# EAGLE design adapter_smd_1.0 (EAGLE 5.10)
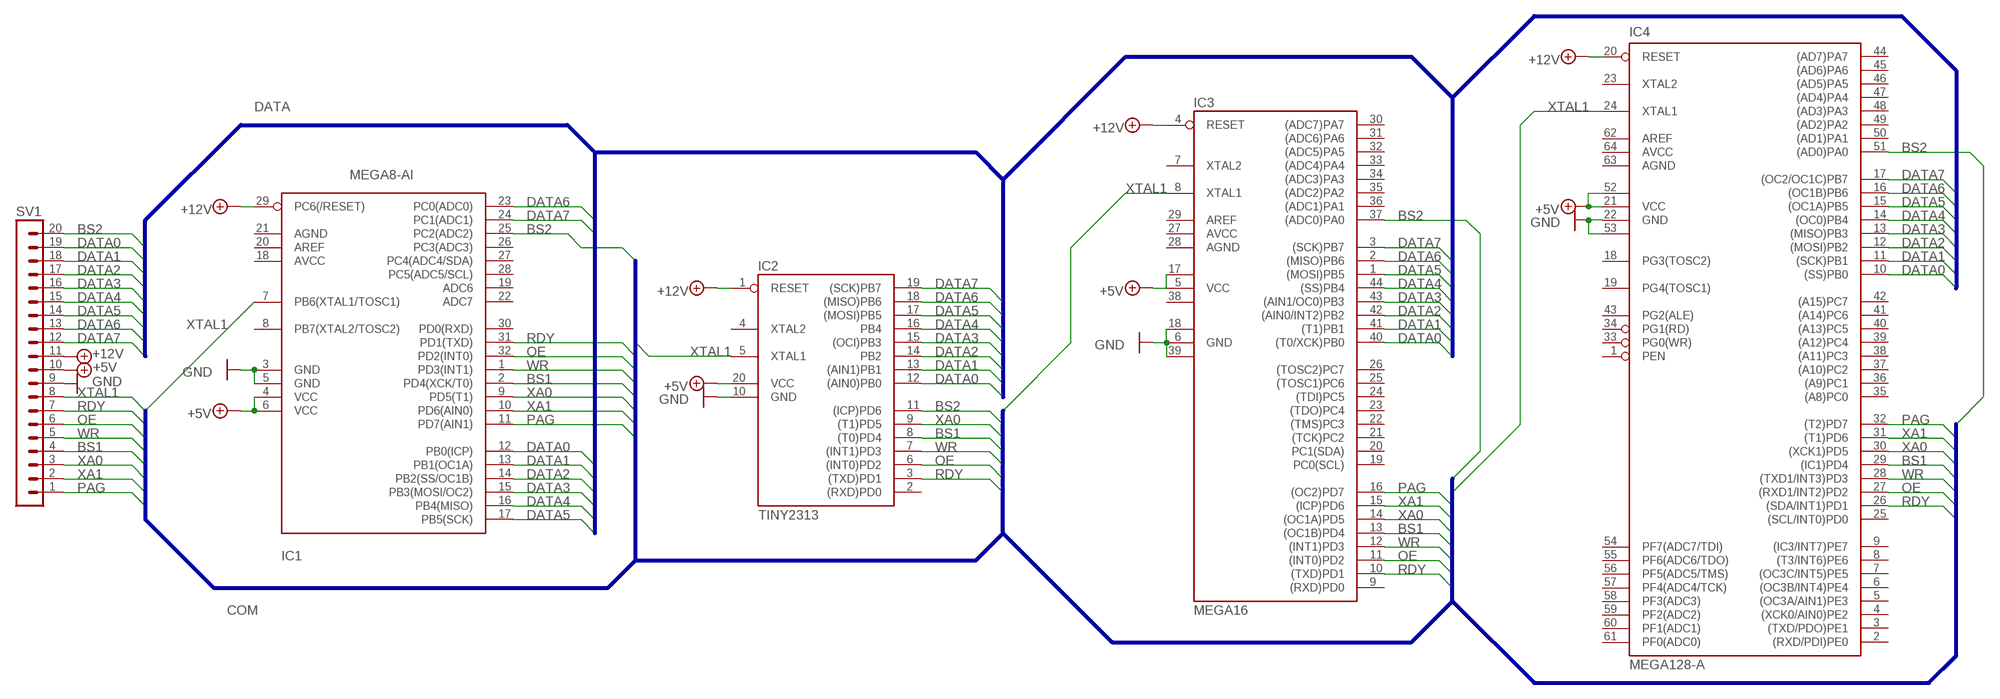
[diagram p0: schematic, sheet 1]

## Parts
IC1  MEGA8-AI  [TQFP32-08]
IC2  TINY2313  AT90S2313S  [SO20L]
IC3  MEGA16  MEGA16-A  [TQFP44]
IC4  MEGA128-A  [TQFP64]
SV1  MA20-1  [MA20-1]

## Nets
+5V: IC1.4(VCC) IC1.6(VCC) IC2.20(VCC) IC3.5(VCC) IC3.17(VCC1) IC4.21(VCC) IC4.52(VCC1) SV1.10
+12V: IC1.29(PC6(/RESET)) IC2.1(RESET) IC3.4(RESET) IC4.20(RESET) SV1.11
BS1: IC1.2(PD4(XCK/T0)) IC2.8((T0)PD4) IC3.13((OC1B)PD4) IC4.29((IC1)PD4) SV1.4
BS2: IC1.25(PC2(ADC2)) IC2.11((ICP)PD6) IC3.37((ADC0)PA0) IC4.51((AD0)PA0) SV1.20
DATA0: IC1.12(PB0(ICP)) IC2.12((AIN0)PB0) IC3.40((T0/XCK)PB0) IC4.10((SS)PB0) SV1.19
DATA1: IC1.13(PB1(OC1A)) IC2.13((AIN1)PB1) IC3.41((T1)PB1) IC4.11((SCK)PB1) SV1.18
DATA2: IC1.14(PB2(SS/OC1B)) IC2.14(PB2) IC3.42((AIN0/INT2)PB2) IC4.12((MOSI)PB2) SV1.17
DATA3: IC1.15(PB3(MOSI/OC2)) IC2.15((OCI)PB3) IC3.43((AIN1/OC0)PB3) IC4.13((MISO)PB3) SV1.16
DATA4: IC1.16(PB4(MISO)) IC2.16(PB4) IC3.44((SS)PB4) IC4.14((OC0)PB4) SV1.15
DATA5: IC1.17(PB5(SCK)) IC2.17((MOSI)PB5) IC3.1((MOSI)PB5) IC4.15((OC1A)PB5) SV1.14
DATA6: IC1.23(PC0(ADC0)) IC2.18((MISO)PB6) IC3.2((MISO)PB6) IC4.16((OC1B)PB6) SV1.13
DATA7: IC1.24(PC1(ADC1)) IC2.19((SCK)PB7) IC3.3((SCK)PB7) IC4.17((OC2/OC1C)PB7) SV1.12
GND: IC1.3(GND) IC1.5(GND) IC2.10(GND) IC3.6(GND) IC3.18(GND1) IC3.39(GND2) IC4.22(GND) IC4.53(GND1) SV1.9
OE: IC1.32(PD2(INT0)) IC2.6((INT0)PD2) IC3.11((INT0)PD2) IC4.27((RXD1/INT2)PD2) SV1.6
PAG: IC1.11(PD7(AIN1)) IC3.16((OC2)PD7) IC4.32((T2)PD7) SV1.1
RDY: IC1.31(PD1(TXD)) IC2.3((TXD)PD1) IC3.10((TXD)PD1) IC4.26((SDA/INT1)PD1) SV1.7
WR: IC1.1(PD3(INT1)) IC2.7((INT1)PD3) IC3.12((INT1)PD3) IC4.28((TXD1/INT3)PD3) SV1.5
XA0: IC1.9(PD5(T1)) IC2.9((T1)PD5) IC3.14((OC1A)PD5) IC4.30((XCK1)PD5) SV1.3
XA1: IC1.10(PD6(AIN0)) IC3.15((ICP)PD6) IC4.31((T1)PD6) SV1.2
XTAL1: IC1.7(PB6(XTAL1/TOSC1)) IC2.5(XTAL1) IC3.8(XTAL1) IC4.24(XTAL1) SV1.8
Unconnected: IC1.8(PB7(XTAL2/TOSC2)) IC1.18(AVCC) IC1.19(ADC6) IC1.20(AREF) IC1.21(AGND) IC1.22(ADC7) IC1.26(PC3(ADC3)) IC1.27(PC4(ADC4/SDA)) IC1.28(PC5(ADC5/SCL)) IC1.30(PD0(RXD)) IC2.2((RXD)PD0) IC2.4(XTAL2) IC3.7(XTAL2) IC3.9((RXD)PD0) IC3.19(PC0(SCL)) IC3.20(PC1(SDA)) IC3.21((TCK)PC2) IC3.22((TMS)PC3) IC3.23((TDO)PC4) IC3.24((TDI)PC5) IC3.25((TOSC1)PC6) IC3.26((TOSC2)PC7) IC3.30((ADC7)PA7) IC3.31((ADC6)PA6) IC3.32((ADC5)PA5) IC3.33((ADC4)PA4) IC3.34((ADC3)PA3) IC3.35((ADC2)PA2) IC3.36((ADC1)PA1) IC4.1(PEN) IC4.2((RXD/PDI)PE0) IC4.3((TXD/PDO)PE1) IC4.4((XCK0/AIN0)PE2) IC4.5((OC3A/AIN1)PE3) IC4.6((OC3B/INT4)PE4) IC4.7((OC3C/INT5)PE5) IC4.8((T3/INT6)PE6) IC4.9((IC3/INT7)PE7) IC4.18(PG3(TOSC2)) IC4.19(PG4(TOSC1)) IC4.23(XTAL2) IC4.25((SCL/INT0)PD0) IC4.33(PG0(WR)) IC4.34(PG1(RD)) IC4.35((A8)PC0) IC4.36((A9)PC1) IC4.37((A10)PC2) IC4.38((A11)PC3) IC4.39((A12)PC4) IC4.40((A13)PC5) IC4.41((A14)PC6) IC4.42((A15)PC7) IC4.43(PG2(ALE)) IC4.44((AD7)PA7) IC4.45((AD6)PA6) IC4.46((AD5)PA5) IC4.47((AD4)PA4) IC4.48((AD3)PA3) IC4.49((AD2)PA2) IC4.50((AD1)PA1) IC4.54(PF7(ADC7/TDI)) IC4.55(PF6(ADC6/TDO)) IC4.56(PF5(ADC5/TMS)) IC4.57(PF4(ADC4/TCK)) IC4.58(PF3(ADC3)) IC4.59(PF2(ADC2)) IC4.60(PF1(ADC1)) IC4.61(PF0(ADC0)) IC4.62(AREF) IC4.63(AGND) IC4.64(AVCC)

## Buses
DATA
COM

## Power pins joined to a net without a drawn wire
AGND: IC3.28(AGND)
AREF: IC3.29(AREF)
AVCC: IC3.27(AVCC)
VCC2: IC3.38(VCC2)

## Library data of the parts
IC1 = avr-6:MEGA8: MICROCONTROLLER 8 Kbytes FLASH 1 kbytes SRAM 512 bytes EEPROM USART 6-channel 10 bit ADC 2-channel 8 bit ADC
IC2 = atmel:AT90S2313: MICROCONTROLLER 2 Kbytes FLASH 128 bytes SRAM 128 bytes EEPROM UART
IC3 = avr-6:MEGA16: MICROCONTROLLER 16 Kbytes FLASH 1 kbytes SRAM 512 bytes EEPROM USART 8-channel 10 bit ADC
IC4 = avr-6:MEGA128: MICROCONTROLLER 128 Kbytes FLASH 4 Kbytes SRAM 4 Kbytes EEPROM DUAL USART 8-channel 10 bit ADC
SV1 = con-lstb:MA20-1: PIN HEADER

## Board
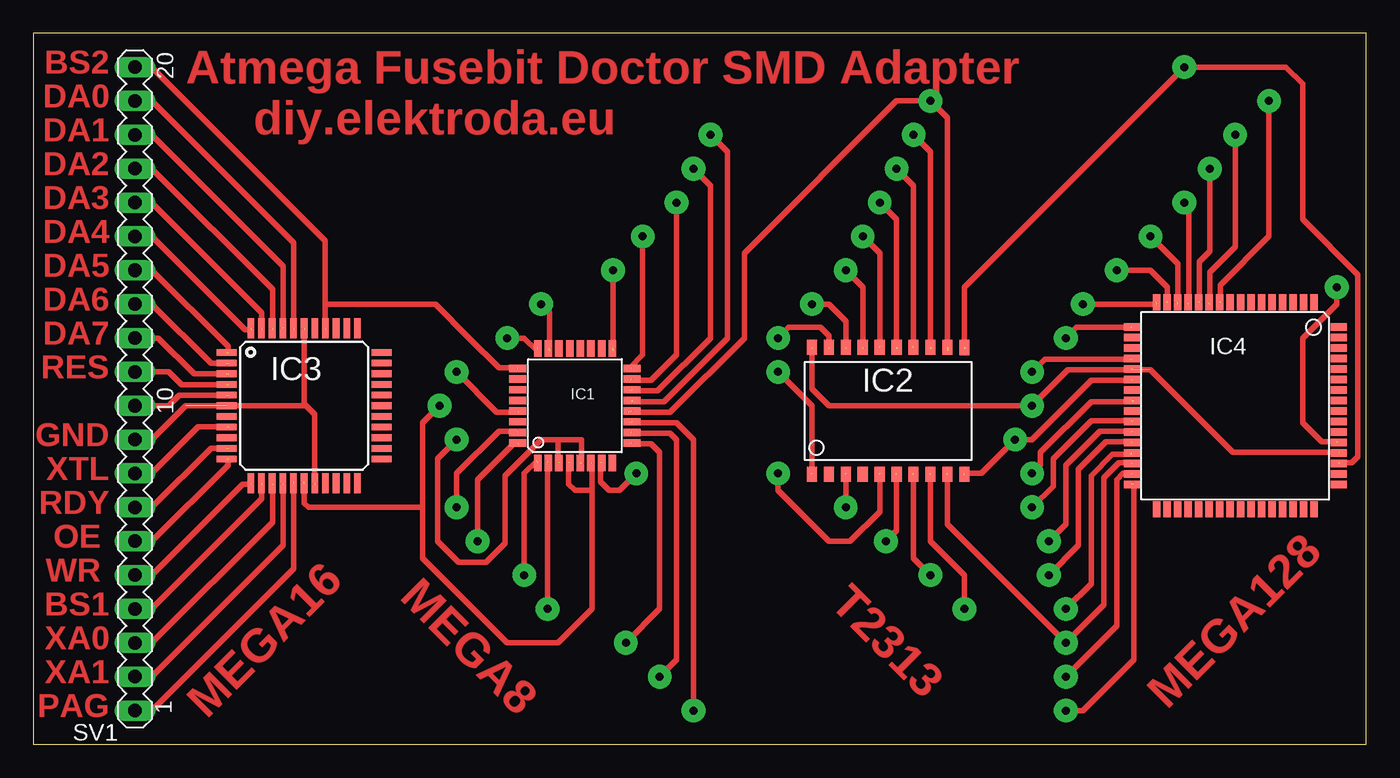
[diagram p1: board, top side]
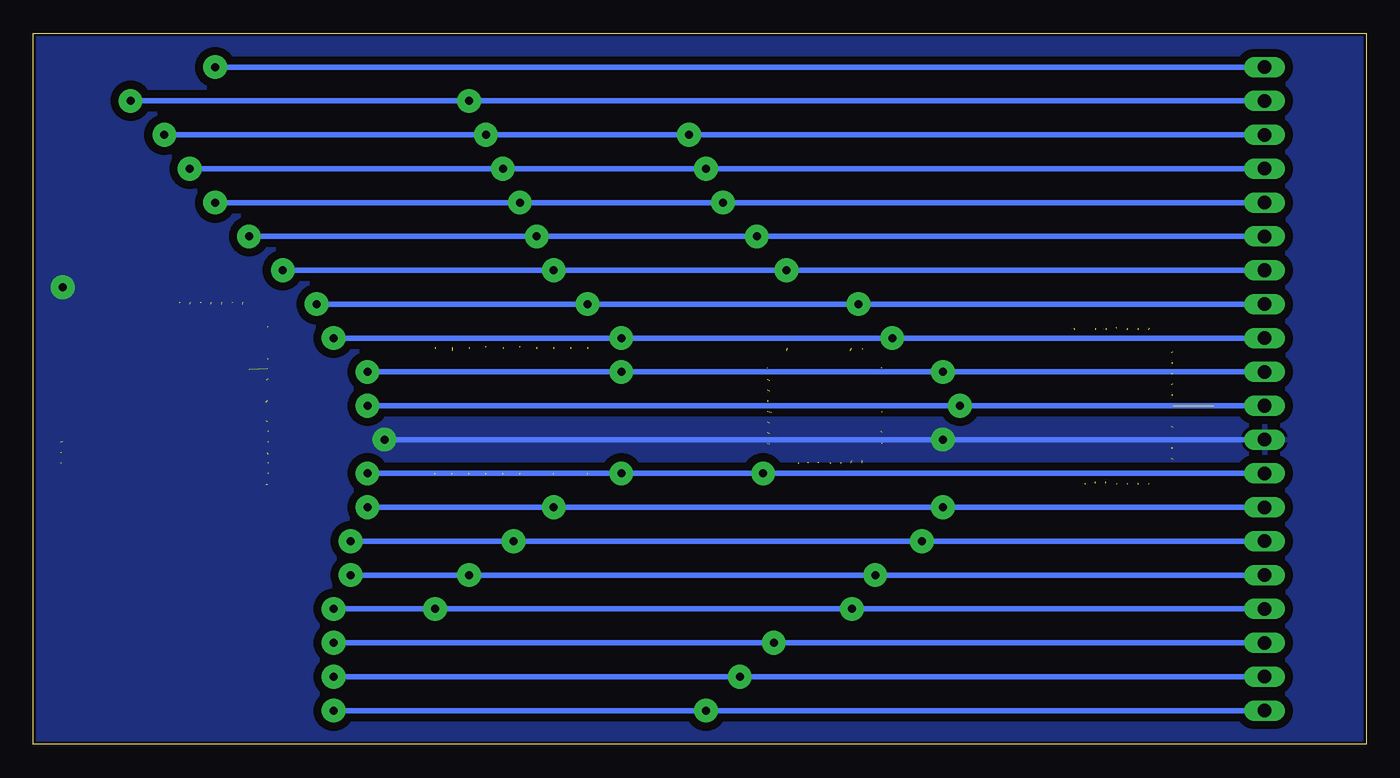
[diagram p2: board, bottom side, seen from below]

Size 100 x 53.33 mm. Coordinates in mm from the lower left corner, seen from the top.
Outline: 0,0 100,0 100,53.33 0,53.33 0,0
Copper layers (1*16): Top 0.035mm / dielectric 1.5mm / Bottom 0.035mm
Design rules "default *": minimum track width 10mil, minimum drill 24mil, track to track 24mil, track to pad 24mil, pad to pad 8mil, via to via 8mil, smd to smd 8mil, copper to edge 8mil, drill to drill 8mil, minimum pad ring 10mil, minimum via ring 8mil, stop-mask expansion 4mil, vias tented up to drill 0mil, thermal gap 10mil

### Footprints (pad centres in the part's own frame; a part is rotated, then mirrored left to right if it is on the bottom)
TQFP32-08 = smd 1.27 x 0.559: 1 -4.293,2.8; 2 -4.293,2; 3 -4.293,1.2; 4 -4.293,0.4; 5 -4.293,-0.4; 6 -4.293,-1.2; 7 -4.293,-2; 8 -4.293,-2.8; 17 4.293,-2.8; 18 4.293,-2; 19 4.293,-1.2; 20 4.293,-0.4; 21 4.293,0.4; 22 4.293,1.2; 23 4.293,2; 24 4.293,2.8 | smd 0.559 x 1.27: 9 -2.8,-4.293; 10 -2,-4.293; 11 -1.2,-4.293; 12 -0.4,-4.293; 13 0.4,-4.293; 14 1.2,-4.293; 15 2,-4.293; 16 2.8,-4.293; 25 2.8,4.293; 26 2,4.293; 27 1.2,4.293; 28 0.4,4.293; 29 -0.4,4.293; 30 -1.2,4.293; 31 -2,4.293; 32 -2.8,4.293
SO20L = smd 0.762 x 1.143: 1 -5.08,-5.131; 2 -3.81,-5.131; 3 -2.54,-5.131; 4 -1.27,-5.131; 5 0,-5.131; 6 1.27,-5.131; 7 2.54,-5.131; 8 3.81,-5.131; 9 5.08,-5.131; 10 6.35,-5.131; 11 6.35,4.369; 12 5.08,4.394; 13 3.81,4.394; 14 2.54,4.394; 15 1.27,4.394; 16 0,4.394; 17 -1.27,4.394; 18 -2.54,4.394; 19 -3.81,4.394; 20 -5.08,4.394
TQFP44 = smd 1.5 x 0.5: 1 -5.8,4; 2 -5.8,3.2; 3 -5.8,2.4; 4 -5.8,1.6; 5 -5.8,0.8; 6 -5.8,0; 7 -5.8,-0.8; 8 -5.8,-1.6; 9 -5.8,-2.4; 10 -5.8,-3.2; 11 -5.8,-4; 23 5.8,-4; 24 5.8,-3.2; 25 5.8,-2.4; 26 5.8,-1.6; 27 5.8,-0.8; 28 5.8,0; 29 5.8,0.8; 30 5.8,1.6; 31 5.8,2.4; 32 5.8,3.2; 33 5.8,4 | smd 0.5 x 1.5: 12 -4,-5.8; 13 -3.2,-5.8; 14 -2.4,-5.8; 15 -1.6,-5.8; 16 -0.8,-5.8; 17 0,-5.8; 18 0.8,-5.8; 19 1.6,-5.8; 20 2.4,-5.8; 21 3.2,-5.8; 22 4,-5.8; 34 4,5.8; 35 3.2,5.8; 36 2.4,5.8; 37 1.6,5.8; 38 0.8,5.8; 39 0,5.8; 40 -0.8,5.8; 41 -1.6,5.8; 42 -2.4,5.8; 43 -3.2,5.8; 44 -4,5.8
TQFP64 = smd 1.194 x 0.559: 1 -7.76,5.905; 2 -7.76,5.118; 3 -7.76,4.331; 4 -7.76,3.543; 5 -7.76,2.756; 6 -7.76,1.968; 7 -7.76,1.181; 8 -7.76,0.394; 9 -7.76,-0.394; 10 -7.76,-1.181; 11 -7.76,-1.968; 12 -7.76,-2.756; 13 -7.76,-3.543; 14 -7.76,-4.331; 15 -7.76,-5.118; 16 -7.76,-5.905; 33 7.76,-5.905; 34 7.76,-5.118; 35 7.76,-4.331; 36 7.76,-3.543; 37 7.76,-2.756; 38 7.76,-1.968; 39 7.76,-1.181; 40 7.76,-0.394; 41 7.76,0.394; 42 7.76,1.181; 43 7.76,1.968; 44 7.76,2.756; 45 7.76,3.543; 46 7.76,4.331; 47 7.76,5.118; 48 7.76,5.905 | smd 0.559 x 1.194: 17 -5.905,-7.76; 18 -5.118,-7.76; 19 -4.331,-7.76; 20 -3.543,-7.76; 21 -2.756,-7.76; 22 -1.968,-7.76; 23 -1.181,-7.76; 24 -0.394,-7.76; 25 0.394,-7.76; 26 1.181,-7.76; 27 1.968,-7.76; 28 2.756,-7.76; 29 3.543,-7.76; 30 4.331,-7.76; 31 5.118,-7.76; 32 5.905,-7.76; 49 5.905,7.76; 50 5.118,7.76; 51 4.331,7.76; 52 3.543,7.76; 53 2.756,7.76; 54 1.968,7.76; 55 1.181,7.76; 56 0.394,7.76; 57 -0.394,7.76; 58 -1.181,7.76; 59 -1.968,7.76; 60 -2.756,7.76; 61 -3.543,7.76; 62 -4.331,7.76; 63 -5.118,7.76; 64 -5.905,7.76
MA20-1 = drill 1.016 long: 1 -24.13,0; 2 -21.59,0; 3 -19.05,0; 4 -16.51,0; 5 -13.97,0; 6 -11.43,0; 7 -8.89,0; 8 -6.35,0; 9 -3.81,0; 10 -1.27,0; 11 1.27,0; 12 3.81,0; 13 6.35,0; 14 8.89,0; 15 11.43,0; 16 13.97,0; 17 16.51,0; 18 19.05,0; 19 21.59,0; 20 24.13,0

### Placement (x,y rotation side)
IC1  40.64,25.4 90 top
IC2  63.5,25.4 0 top
IC3  20.32,25.4 0 top
IC4  90.17,25.4 270 top
SV1  7.62,26.67 90 top

### Tracks (layer width: path | path; a pad name or v marks a point on that pad's centre or on a via)
+5V  (via drill 0.6 pad 1.78)  (7 unrouted)
  Top 0.406: SV1.10 10.16,25.4 10.95,26.19 14.61,26.19 | 58.42,29.69 58.42,26.67 59.69,25.4 v74.93,25.4 77.63,28.1 83.82,28.1 90.01,21.91 97.95,21.91 | v30.48,25.4 29.21,24.13 29.21,17.78 | 29.21,17.78 29.21,13.97 35.56,7.62 39.37,7.62 41.91,10.16 41.91,19.05 | 41.91,19.05 41.91,21.11 | 29.21,17.78 20.64,17.78 20.32,18.1 20.32,19.68 | 41.91,19.05 40.64,19.05 40.16,19.53 40.16,21.11
  Bottom 0.406: SV1.10 v30.48,25.4 v74.93,25.4
+12V  (via drill 0.6 pad 1.78)  (4 unrouted)
  Top 0.406: v74.93,27.94 75.88,28.89 82.39,28.89 | SV1.11 10.16,27.94 11.11,26.99 14.61,26.99 | v55.88,27.94 58.42,25.4 58.42,20.32 | v31.75,27.94 34.77,24.92 36.35,24.92
  Bottom 0.406: SV1.11 v31.75,27.94 v55.88,27.94 v74.93,27.94
BS1  (via drill 0.6 pad 1.78)  (4 unrouted)
  Top 0.406: v77.47,10.16 79.38,12.06 79.38,20.16 80.96,21.75 82.39,21.75 | SV1.4 8.89,10.16 17.14,18.41 17.14,19.53 | v69.85,10.16 69.85,12.7 67.31,15.24 67.31,20.32 | v38.58,10.16 38.58,10.48 38.58,15.56 38.58,16.99 38.58,21.27
  Bottom 0.406: SV1.4 v38.58,10.16 v69.85,10.16 v77.47,10.16
BS2  (via drill 0.6 pad 1.78)  (4 unrouted)
  Top 0.406: 97.95,21.11 98.9,21.11 99.38,21.59 99.38,35.24 95.25,39.37 95.25,49.53 93.98,50.8 v86.36,50.8 69.85,34.29 69.85,29.69 | SV1.20 8.89,50.8 21.91,37.78 21.91,33.02 | 21.91,31.11 21.91,33.02 | 21.91,33.02 30.16,33.02 32.7,30.48 | 32.7,30.48 | 32.7,30.48 34.92,28.26 36.35,28.26
  Bottom 0.406: SV1.20 v86.36,50.8
DATA0  (via drill 0.6 pad 1.78)  (4 unrouted)
  Top 0.406: v92.71,48.26 92.71,38.1 89.06,34.45 89.06,33.18 | SV1.19 8.89,48.26 19.53,37.62 19.53,31.11 | 68.58,29.53 68.58,46.99 v67.31,48.26 64.77,48.26 53.34,36.83 53.34,30.48 47.78,24.92 44.61,24.92
  Bottom 0.406: SV1.19 v67.31,48.26 v92.71,48.26
DATA1  (via drill 0.6 pad 1.78)  (4 unrouted)
  Top 0.406: v90.17,45.72 90.17,37.31 88.27,35.4 88.27,33.02 | SV1.18 8.89,45.72 18.73,35.88 18.73,31.27 | v66.04,45.72 67.31,44.45 67.31,29.69 | v50.8,45.72 52.07,44.45 52.07,30.48 47.31,25.72 44.93,25.72
  Bottom 0.406: SV1.18 v50.8,45.72 v66.04,45.72 v90.17,45.72
DATA2  (via drill 0.6 pad 1.78)  (4 unrouted)
  Top 0.406: v88.27,43.18 88.27,36.99 87.47,36.2 87.47,33.18 | SV1.17 8.89,43.18 17.94,34.13 17.94,31.11 | v64.77,43.18 66.04,41.91 66.04,29.84 | v49.53,43.18 50.8,41.91 50.8,30.48 46.83,26.51 44.77,26.51
  Bottom 0.406: SV1.17 v49.53,43.18 v64.77,43.18 v88.27,43.18
DATA3  (via drill 0.6 pad 1.78)  (4 unrouted)
  Top 0.406: v86.36,40.64 86.68,40.32 86.68,33.02 | SV1.16 8.89,40.64 17.14,32.38 17.14,31.11 | v63.5,40.64 64.77,39.37 64.77,29.69 | v48.26,40.64 48.26,29.21 46.35,27.3 44.77,27.3
  Bottom 0.406: SV1.16 v48.26,40.64 v63.5,40.64 v86.36,40.64
DATA4  (via drill 0.6 pad 1.78)  (4 unrouted)
  Top 0.406: v83.82,38.1 85.88,36.04 85.88,33.02 | SV1.15 8.89,38.1 15.88,31.11 16.35,31.11 | v62.23,38.1 63.5,36.83 63.5,29.84 | v45.72,38.1 45.72,29.21 44.77,28.26 44.93,28.26
  Bottom 0.406: SV1.15 v45.72,38.1 v62.23,38.1 v83.82,38.1
DATA5  (via drill 0.6 pad 1.78)  (4 unrouted)
  Top 0.406: v81.28,35.56 83.82,35.56 85.09,34.29 85.09,33.18 | SV1.14 8.89,35.56 14.61,29.84 14.61,29.37 | v60.96,35.56 62.23,34.29 62.23,29.69 | v43.5,35.56 43.5,29.53
  Bottom 0.406: SV1.14 v43.5,35.56 v60.96,35.56 v81.28,35.56
DATA6  (via drill 0.6 pad 1.78)  (4 unrouted)
  Top 0.406: v78.74,33.02 84.3,33.02 | SV1.13 8.89,33.02 13.34,28.57 14.61,28.57 | v58.42,33.02 59.69,33.02 60.96,31.75 60.96,29.69 | v38.1,33.02 38.73,32.38 38.73,29.53
  Bottom 0.406: SV1.13 v38.1,33.02 v58.42,33.02 v78.74,33.02
DATA7  (via drill 0.6 pad 1.78)  (4 unrouted)
  Top 0.406: v77.47,30.48 78.26,31.27 82.39,31.27 | SV1.12 9.37,30.48 12.06,27.78 14.61,27.78 | v55.88,30.48 56.67,31.27 59.05,31.27 59.69,30.64 59.69,29.69 | v35.56,30.48 36.83,30.48 37.78,29.53 37.78,29.69
  Bottom 0.406: SV1.12 v35.56,30.48 v55.88,30.48 v77.47,30.48
GND  (via drill 0.6 pad 1.78)  (8 unrouted)
  Top 0.406: 82.55,27.3 79.38,27.3 74.93,22.86 v73.66,22.86 71.12,20.32 69.85,20.32 | SV1.9 8.89,22.86 11.43,25.4 20.32,25.4 20.32,25.56 | v31.75,22.86 30.32,21.43 30.32,15.24 31.91,13.65 33.97,13.65 35.4,15.08 35.4,20.16 38.1,22.86 39.37,22.86 | 39.37,22.86 39.37,21.11 | v97.79,34.29 97.79,33.02 95.25,30.48 95.25,24.13 96.68,22.7 97.79,22.7 | 20.32,25.56 20.32,31.11 | 20.32,25.56 21.11,24.77 21.11,19.53 | 39.37,22.86 41.12,22.86 41.12,21.11
  Bottom 0.406: SV1.9 v31.75,22.86 v73.66,22.86
  pour Bottom: 0,53.34 100.33,53.34 100.33,0 0,0
OE  (via drill 0.6 pad 1.78)  (4 unrouted)
  Top 0.406: v76.2,15.24 77.47,16.51 77.47,20.95 80.01,23.5 82.39,23.5 | SV1.6 8.89,15.24 14.61,20.95 14.61,21.43 | v63.98,15.24 64.77,16.03 64.77,20.32 | v33.34,15.24 33.34,19.84 36.04,22.54 36.35,22.54
  Bottom 0.406: SV1.6 v33.34,15.24 v63.98,15.24 v76.2,15.24
PAG  (via drill 0.6 pad 1.78)  (3 unrouted)
  Top 0.406: v77.47,2.54 78.74,2.54 82.55,6.35 82.55,19.53 | SV1.1 8.89,2.54 19.53,13.18 19.53,19.68 | v49.53,2.54 49.53,22.86 48.26,24.13 44.77,24.13
  Bottom 0.406: SV1.1 v49.53,2.54 v77.47,2.54
RDY  (via drill 0.6 pad 1.78)  (4 unrouted)
  Top 0.406: v74.93,17.78 76.52,19.37 76.52,21.43 79.38,24.29 82.55,24.29 | SV1.7 8.89,17.78 13.34,22.23 14.61,22.23 | v60.96,17.78 60.96,20.32 | v31.75,17.78 31.75,20.32 34.92,23.5 36.35,23.5
  Bottom 0.406: SV1.7 v31.75,17.78 v60.96,17.78 v74.93,17.78
WR  (via drill 0.6 pad 1.78)  (4 unrouted)
  Top 0.406: v76.2,12.7 78.42,14.92 78.42,20.64 80.49,22.7 82.39,22.7 | SV1.5 8.89,12.7 15.72,19.53 16.35,19.53 | v67.31,12.7 66.04,13.97 66.04,20.32 | v36.83,12.7 36.83,20.32 37.78,21.27
  Bottom 0.406: SV1.5 v36.83,12.7 v67.31,12.7 v76.2,12.7
XA0  (via drill 0.6 pad 1.78)  (4 unrouted)
  Top 0.406: 82.39,21.11 81.44,21.11 80.33,20 80.33,10.48 v77.47,7.62 68.58,16.51 68.58,20.32 | SV1.3 8.89,7.62 17.94,16.67 17.94,19.53 | v44.45,7.62 46.99,10.16 46.99,19.05 46.99,21.91 46.35,22.54 44.77,22.54
  Bottom 0.406: SV1.3 v44.45,7.62 v77.47,7.62
XA1  (via drill 0.6 pad 1.78)  (3 unrouted)
  Top 0.406: v77.47,5.08 81.28,8.89 81.28,19.84 81.76,20.32 82.39,20.32 | SV1.2 8.89,5.08 18.73,14.92 18.73,19.53 | v46.99,5.08 48.26,6.35 48.26,22.86 47.78,23.34 44.77,23.34
  Bottom 0.406: SV1.2 v46.99,5.08 v77.47,5.08
XTAL1  (via drill 0.6 pad 1.78)  (4 unrouted)
  Top 0.406: v74.93,20.32 75.56,20.95 75.56,21.91 79.38,25.72 82.55,25.72 | SV1.8 8.89,20.32 12.38,23.81 14.61,23.81 | v55.88,20.32 55.88,19.05 59.69,15.24 61.28,15.24 63.5,17.46 63.5,20.32 | v45.24,20.32 43.97,19.05 43.18,19.05 42.55,19.68 42.55,21.11
  Bottom 0.406: SV1.8 v45.24,20.32 v55.88,20.32 v74.93,20.32

### Text on the board
Top: BS2 | DA0 | Atmega Fusebit Doctor SMD Adapter | DA1 | diy.elektroda.eu | DA2 | DA3 | DA4 | DA5 | DA6 | DA7 | RES | GND | XTL | RDY | OE | WR | MEGA16 | BS1 | XA0 | XA1 | T2313 | PAG | MEGA8 | MEGA128